# EAGLE design powerSMALL_smaller (EAGLE 9.0.0)
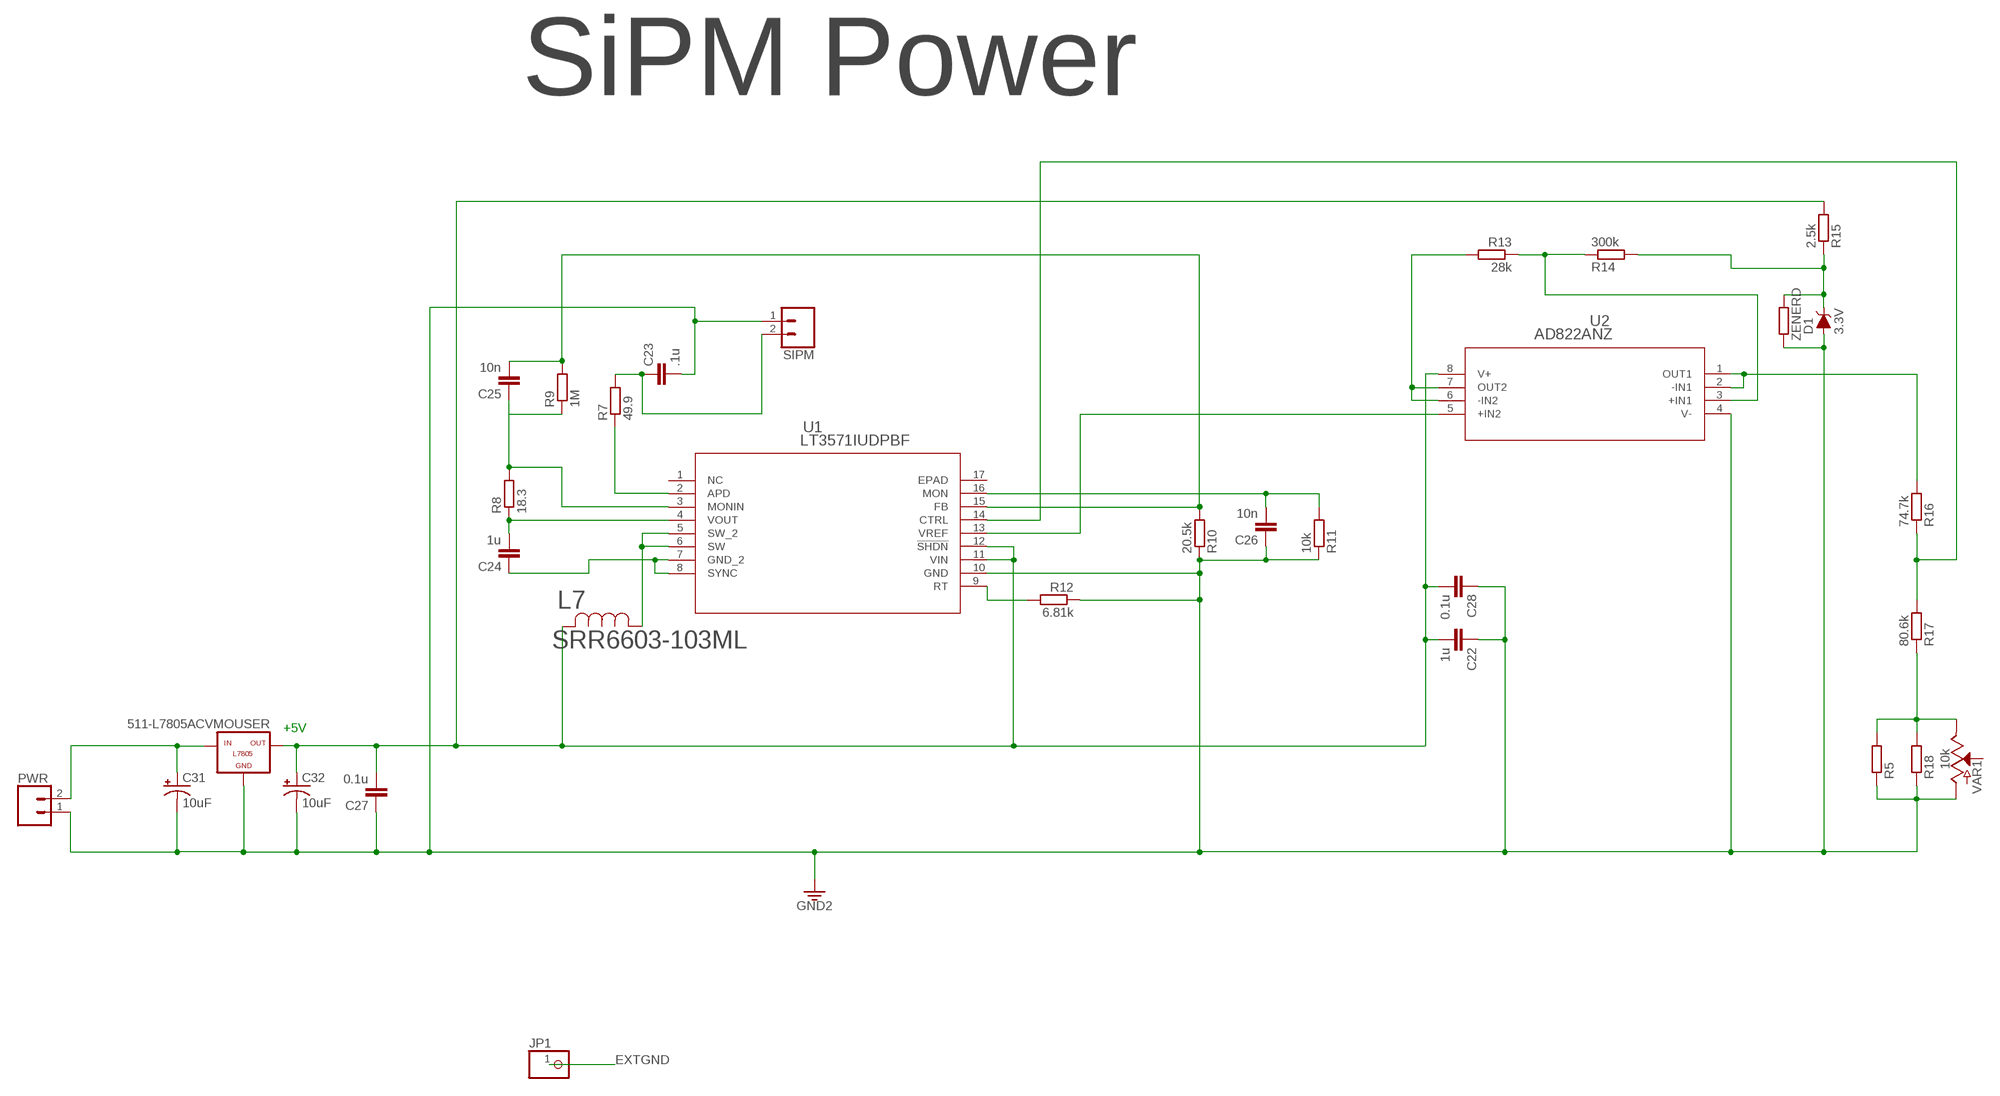
[diagram p0: schematic, sheet 1, part 1 of 2]
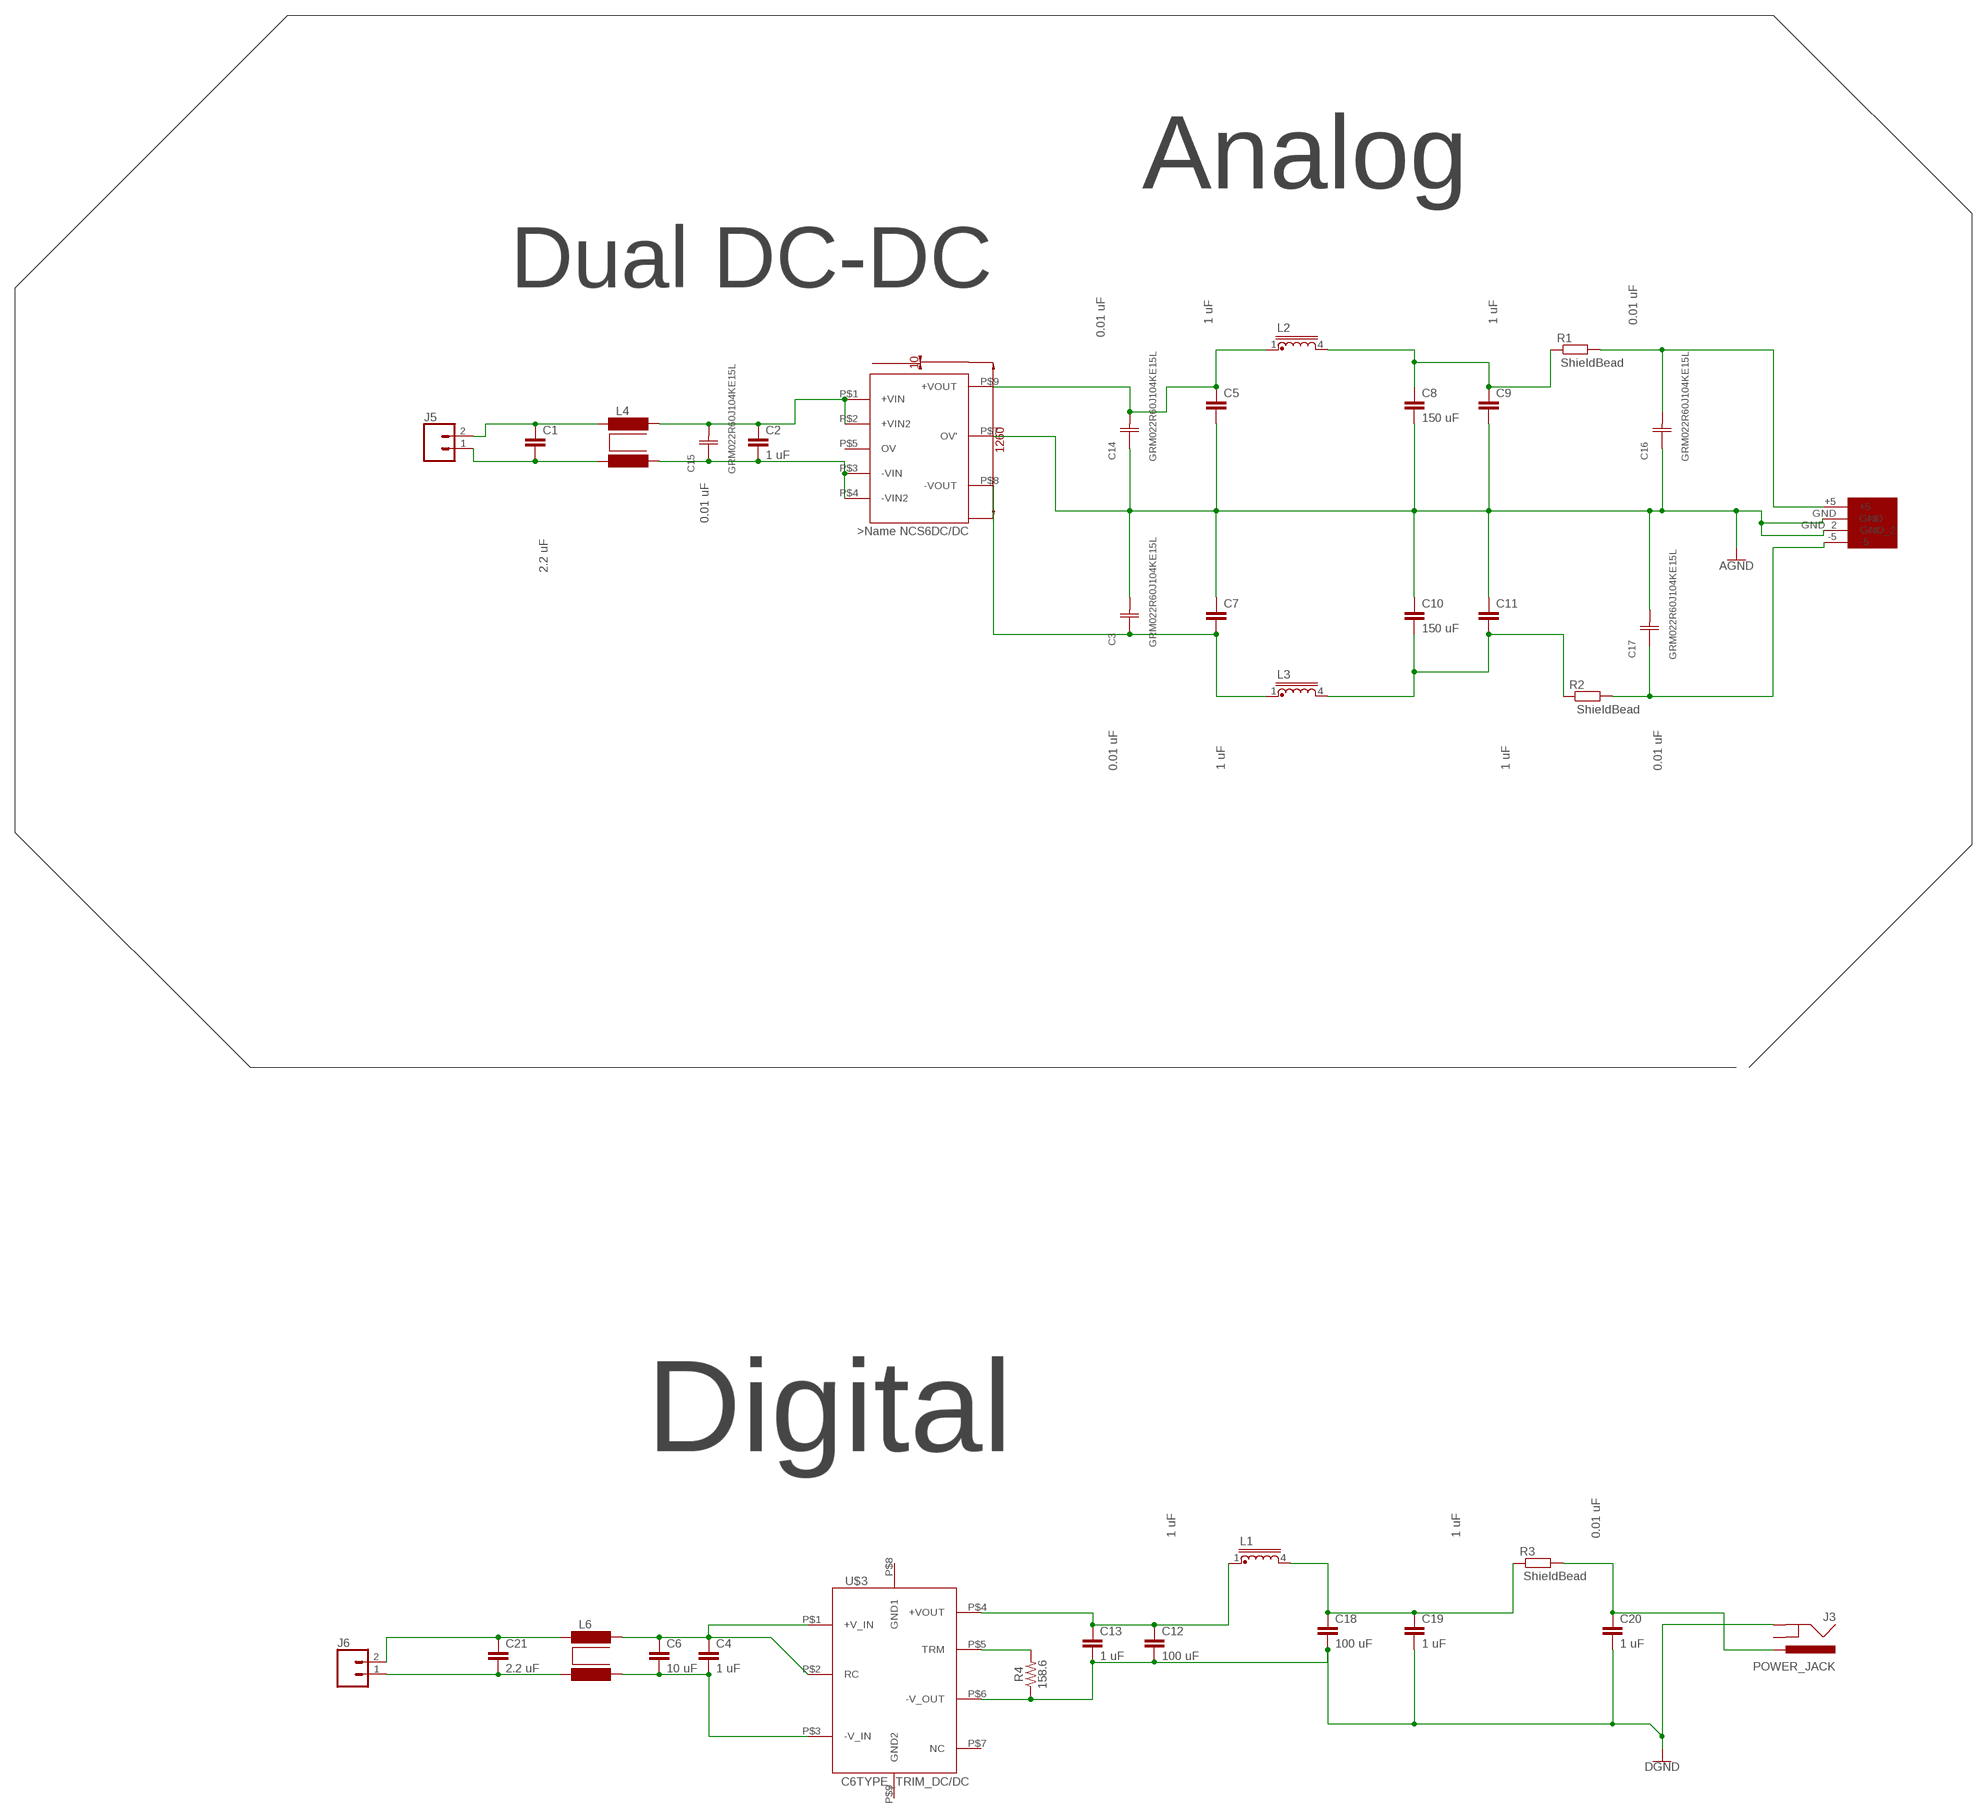
[diagram p1: schematic, sheet 1, part 2 of 2]

## Parts
511-L7805ACVMOUSER  -L7805  [L7805]
C1  C2.5/2  [C2.5-2]
C2  1 uF  10NF-PTH-10MM-10000V-1-%  [CAP-PTH-10MM]
C3  GRM022R60J104KE15L  [CAP_GRM02L_P42XP22]
C4  1 uF  10NF-PTH-10MM-10000V-1-%  [CAP-PTH-10MM]
C5  C2.5/2  [C2.5-2]
C6  10 uF  10NF-PTH-10MM-10000V-1-%  [CAP-PTH-10MM]
C7  C2.5/2  [C2.5-2]
C8  150 uF  10NF-PTH-10MM-10000V-1-%  [CAP-PTH-10MM]
C9  C2.5/2  [C2.5-2]
C10  150 uF  10NF-PTH-10MM-10000V-1-%  [CAP-PTH-10MM]
C11  C2.5/2  [C2.5-2]
C12  100 uF  10NF-PTH-10MM-10000V-1-%  [CAP-PTH-10MM]
C13  1 uF  10NF-PTH-10MM-10000V-1-%  [CAP-PTH-10MM]
C14  GRM022R60J104KE15L  [CAP_GRM02L_P42XP22]
C15  GRM022R60J104KE15L  [CAP_GRM02L_P42XP22]
C16  GRM022R60J104KE15L  [CAP_GRM02L_P42XP22]
C17  GRM022R60J104KE15L  [CAP_GRM02L_P42XP22]
C18  100 uF  10NF-PTH-10MM-10000V-1-%  [CAP-PTH-10MM]
C19  1 uF  10NF-PTH-10MM-10000V-1-%  [CAP-PTH-10MM]
C20  1 uF  10NF-PTH-10MM-10000V-1-%  [CAP-PTH-10MM]
C21  2.2 uF  10NF-PTH-10MM-10000V-1-%  [CAP-PTH-10MM]
C22  1u  C2.5/2  [C2.5-2]
C23  .1u  C2.5/2  [C2.5-2]
C24  1u  C2.5/2  [C2.5-2]
C25  10n  C2.5/2  [C2.5-2]
C26  10n  C2.5/2  [C2.5-2]
C27  0.1u  C2.5/2  [C2.5-2]
C28  0.1u  C2.5/2  [C2.5-2]
C31  10uF  10UF-POLAR-0603-6.3V-20%(TANT)  [0603-POLAR]
C32  10uF  10UF-POLAR-0603-6.3V-20%(TANT)  [0603-POLAR]
D1  3.3V  DIODE-ZENER-MM3Z3V3T1G  [SOD-323]
J3  POWER_JACK  [POWER_JACK_PTH]
J5  CONN_02PTH4  [1X02_XTRA_BIG]
J6  CONN_02PTH4  [1X02_XTRA_BIG]
JP1  PINHD-1X1  [1X01]
L1  U15-CHOKE  [U15CHOKE]
L2  U15-CHOKE  [U15CHOKE]
L3  U15-CHOKE  [U15CHOKE]
L4  SMR6-I  [SM-R6]
L6  SMR6-I  [SM-R6]
L7  SRR6603-103ML  [IND_BOURNS_SRR6603]
PWR  CONN_02PTH4  [1X02_XTRA_BIG]
R1  R0207/10  [0207/10]
R2  R0207/10  [0207/10]
R3  R0207/10  [0207/10]
R4  158.6  10MOHM-HORIZ-1/4W-5%  [AXIAL-0.3]
R5  R0207/10  [0207/10]
R7  49.9  R0207/10  [0207/10]
R8  18.3  R0207/10  [0207/10]
R9  1M  R0207/10  [0207/10]
R10  20.5k  R0207/10  [0207/10]
R11  10k  R0207/10  [0207/10]
R12  6.81k  R0207/10  [0207/10]
R13  28k  R0207/10  [0207/10]
R14  300k  R0207/10  [0207/10]
R15  2.5k  R0207/10  [0207/10]
R16  74.7k  R0207/10  [0207/10]
R17  80.6k  R0207/10  [0207/10]
R18  R0207/10  [0207/10]
SIPM  CONN_02PTH4  [1X02_XTRA_BIG]
U1  LT3571IUDPBF  [QFN-16_UD]
U2  AD822ANZ  [N_8]
U$1  NCS6D1205  [NCS6D1205C]
U$3  C6TYPE_TRIM_DC/DC  [CONV/DC/DC_6W_SNGL_C6TYPE]
U$4  WM403_NDPOWER_JACK  [WM4302-ND]
VAR1  10k  POTENTIOMETER-PTH-9MM-1/20W-20%  [POT-PTH-ALPS]
ZENERD  R0207/10  [0207/10]

## Nets
5VSUPPLY: 511-L7805ACVMOUSER.OUT C22.2 C27.2 C28.2 C32.+ L7.2 R15.2 U1.11(VIN) U1.12(!SHDN) U2.8(V+)
-FINV: C16.2 R1.2 U$4.+5
AGND: C3.2 C5.2 C7.1 C8.2 C9.2 C10.1 C11.1 C14.1 C16.1 C17.2 U$1.P$7(OV') U$4.GND U$4.GND_2
DGND: C12.2 C13.2 C18.2 C19.2 C20.2 J3.GND R4.P$1 U$3.P$6(-V_OUT)
EXTGND: JP1.1
N$1: C1.1 J5.2 L4.1
N$2: C1.2 J5.1 L4.4
N$3: C3.1 C7.2 L3.1 U$1.P$8(-VOUT)
N$4: C2.1 C15.2 L4.8 U$1.P$1(+VIN) U$1.P$2(+VIN2)
N$5: C5.1 C14.2 L2.1 U$1.P$9(+VOUT)
N$6: C8.1 C9.1 L2.4 R1.1
N$7: R13.2 U2.6(-IN2) U2.7(OUT2)
N$8: C10.2 C11.2 L3.4 R2.1
N$9: C17.1 R2.2 U$4.-5
N$10: C21.1 J6.2 L6.1
N$11: C21.2 J6.1 L6.4
N$12: C4.1 C6.1 L6.8 U$3.P$1(+V_IN) U$3.P$2(RC)
N$13: C4.2 C6.2 L6.5 U$3.P$3(-V_IN)
N$14: C24.2 R8.1 U1.4(VOUT)
N$15: C20.1 J3.PWR R3.2
N$16: R4.P$2 U$3.P$5(TRM)
N$17: C18.1 C19.1 L1.4 R3.1
N$18: C24.1 U1.7(GND_2) U1.8(SYNC)
N$19: C12.1 C13.1 L1.1 U$3.P$4(+VOUT)
N$20: R7.1 U1.2(APD)
N$21: C23.1 R7.2 SIPM.2
N$22: C25.1 R8.2 R9.1 U1.3(MONIN)
N$23: C26.2 R11.2 U1.16(MON)
N$24: L7.1 U1.5(SW_2) U1.6(SW)
N$25: U1.13(VREF) U2.5(+IN2)
N$27: R16.2 U2.1(OUT1) U2.2(-IN1)
N$28: C25.2 R9.2 R10.2 U1.15(FB)
N$29: R13.1 R14.1 U2.3(+IN1)
N$30: R12.2 U1.9(RT)
N$31: D1.C R14.2 R15.1 ZENERD.2
N$33: R16.1 R17.2 U1.14(CTRL)
N$34: R5.2 R17.1 R18.2 VAR1.P$1(E)
N$35: C2.2 C15.1 L4.5 U$1.P$3(-VIN) U$1.P$4(-VIN2)
N$36: 511-L7805ACVMOUSER.IN C31.+ PWR.2
SIPMGND: 511-L7805ACVMOUSER.GND C22.1 C23.2 C26.1 C27.1 C28.1 C31.- C32.- D1.A PWR.1 R5.1 R10.1 R11.1 R12.1 R18.1 SIPM.1 U1.10(GND) U2.4(V-) VAR1.P$3(A) ZENERD.1 ; supply symbol labelled GND2
Unconnected: J3.GNDBREAK U1.1(NC) U1.17(EPAD) U$1.P$5(OV) U$3.P$7(NC) U$3.P$8(GND1) U$3.P$9(GND2) VAR1.P$2(S)

## Notes on the sheet
- SiPM Power
- +5V
- Analog
- Dual DC-DC
- 1 uF | 1 uF
- 0.01 uF
- 0.01 uF
- ShieldBead
- 0.01 uF
- 2.2 uF
- ShieldBead
- 1 uF | 1 uF
- 0.01 uF | 0.01 uF
- Digital
- 1 uF | 1 uF
- 0.01 uF
- ShieldBead

## Library data of the parts
511-L7805ACVMOUSER = tango:-L7805
C1 C5 C7 C9 C11 C22-C28 = capacitor-wima:C: CAPACITOR naming: grid - package width
C2 C4 C6 C8 C10 C12 C13 C18-C21 = SparkFun-Capacitors:10NF: 0.01uF/10nF/10,000pF ceramic capacitors A capacitor is a passive two-terminal electrical component used to store electrical energy temporarily in an electric field. CAP-09321; PROD_ID: CAP-09321; VALUE: 10nF
C3 C14-C17 = 00_1uFCeramic:GRM022R60J104KE15L; MANUFACTURER_PART_NUMBER: GRM022R60J104KE15L; VENDOR: Murata
C31 C32 = SparkFun-Capacitors:10UF-POLAR: 10.0µF polarized capacitors A capacitor is a passive two-terminal electrical component used to store electrical energy temporarily in an electric field.; PROD_ID: CAP-13210
D1 = SparkFun-DiscreteSemi:DIODE-ZENER: Zener Diode A Zener diode allows current to flow from its anode to its cathode like a normal semiconductor diode, but it also permits current to flow in the reverse direction when its "Zener voltage" is reached. - WIkipedia; PROD_ID: DIO-11284
J3 = SparkFun-Connectors:POWER_JACK: Power Jack Connector This is the standard 5.5mm barrel jack for power. The PTH is the most common, proven, reliable, footprint. The Slot footprint only works if the mill layer is transmitted to the PCB fab house so be warned. Here are the connectors we sell at SparkFun: DC Barrel Power Jack/Connector <https://www.sparkfun.com/products/119> (PRT-00119) DC Barrel Power Jack/Connector (SMD) <https://www.sparkfun.com/products/12748> (PRT-12748) DC Barrel Jack Adapter - Breadboard Compatible <https://www.sparkfun.com/products/10811> (PRT-10811) It is used on this SparkFun product (and many, many others): SparkFun RedBoard - Programmed with Arduino <https://www.sparkfun.com/products/12757> (DEV-12757) Also, if you need a mating power supply or connector, please check these out: Wall Adapter Power Supply - 9VDC 650mA <https://www.sparkfun.com/products/298> (TOL-00298) DC Barrel Jack Adapter - Male <https://www.sparkfun.com/products/10287> (PRT-10287); PROD_ID: CONN-08197
J5 J6 PWR SIPM = SparkFun-Connectors:CONN_02: Multi connection point. Often used as Generic Header-pin footprint for 0.1 inch spaced/style header connections On any of the 0.1 inch spaced packages, you can populate with these: Break Away Headers - Straight <https://www.sparkfun.com/products/116> (PRT-00116) Break Away Male Headers - Right Angle <https://www.sparkfun.com/products/553> (PRT-00553) Female Headers <https://www.sparkfun.com/products/115> (PRT-00115) Break Away Headers - Machine Pin <https://www.sparkfun.com/products/117> (PRT-00117) Break Away Female Headers - Swiss Machine Pin <https://www.sparkfun.com/products/743> (PRT-00743) For SCREWTERMINALS and SPRING TERMINALS visit here: Screw Terimnals on SparkFun.com <https://www.sparkfun.com/search/results?term=Screw+Terminals> (5mm/3.5mm/2.54mm spacing) This device is also useful as a general connection point to wire up your design to another part of your project. Our various solder wires solder well into these plated through hole pads. Hook-Up Wire - Assortment (Stranded, 22 AWG) <https://www.sparkfun.com/products/11375> (PRT-11375) Hook-Up Wire - Assortment (Solid Core, 22 AWG) <https://www.sparkfun.com/products/11367> (PRT-11367) View the entire wire category on our website here <https://www.sparkfun.com/categories/141> Special notes: Molex polarized connector foot print use with: PRT-08233 with associated crimp pins and housings. 2.54_SCREWTERM for use with PRT-10571. 3.5mm Screw Terminal footprints for PRT-08084 5mm Screw Terminal footprints for use with PRT-08432
JP1 = adafruit:PINHD-1X1: Pin header 1x1 for 0.1" spacing With round pins
L1-L3 = inductor-neosid:U15-: CHOKE U15; OC_FARNELL: unknown; OC_NEWARK: unknown
L4 L6 = inductor-neosid:SMR6-I: CHOKE current compensated toroidal-core choke; OC_FARNELL: unknown; OC_NEWARK: unknown
L7 = SRR6603-10MLTR-ND:SRR6603-103ML; MANUFACTURER_PART_NUMBER: SRR6603103ML; VENDOR: Bourns Electronics
R1-R3 R5 R7-R18 ZENERD = eagle-ltspice:R: RESISTOR, European symbol; SPICEMODEL: NONE; SPICEPREFIX: R
R4 = SparkFun-Resistors:10MOHM: RES-09327; PROD_ID: RES-09327; VALUE: 10M
U1 = LT3571:LT3571IUDPBF; MANUFACTURER_PART_NUMBER: LT3571IUD#PBF; VENDOR: Linear Technology
U2 = AD822ANZ_opAmp:AD822ANZ; MANUFACTURER_PART_NUMBER: AD822ANZ; VENDOR: Analog Devices Inc
U$1 = LAFTRPWR:NCS6D1205
U$3 = DCDC_Trim:C6TYPE_TRIM_DC/DC
U$4 = WM4302-ND:WM403_ND
VAR1 = SparkFun-Resistors:POTENTIOMETER: Potentiometer (Pot) Three-terminal potentiometers, with an adjustable wiper and two adjustable resistors. A pot can be used to create a configurable voltage divider, or as a variable resistor. Variants ALPS_POT and ALPS_POT_KIT - PTH, breadboard compatible, 9mm square pots Rotary Potentiometer - Linear (10k ohm) <https://www.sparkfun.com/products/9288> (COM-09288) The KIT variant exposes copper on only one side of the PTH pad, so the part can only be assembled on one side of the PCB. Useful for beginner soldering kits.; PROD_ID: RES-09177; SF_SKU: COM-09288

## Board
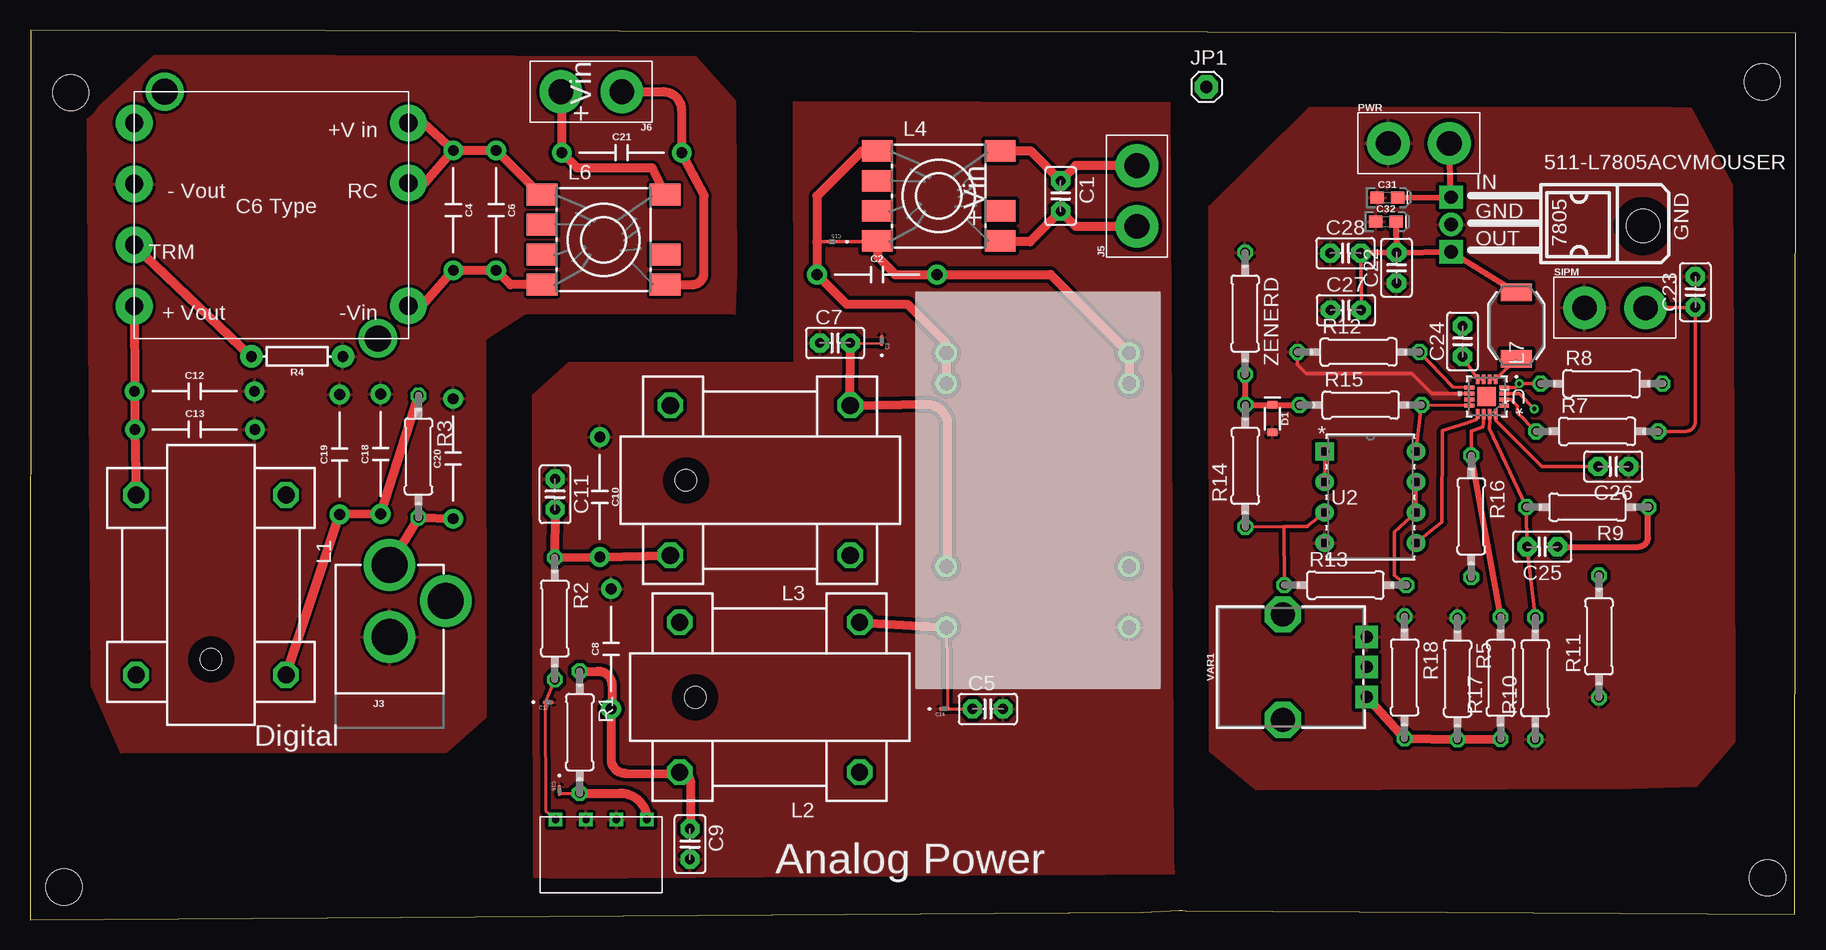
[diagram p2: board, top side]
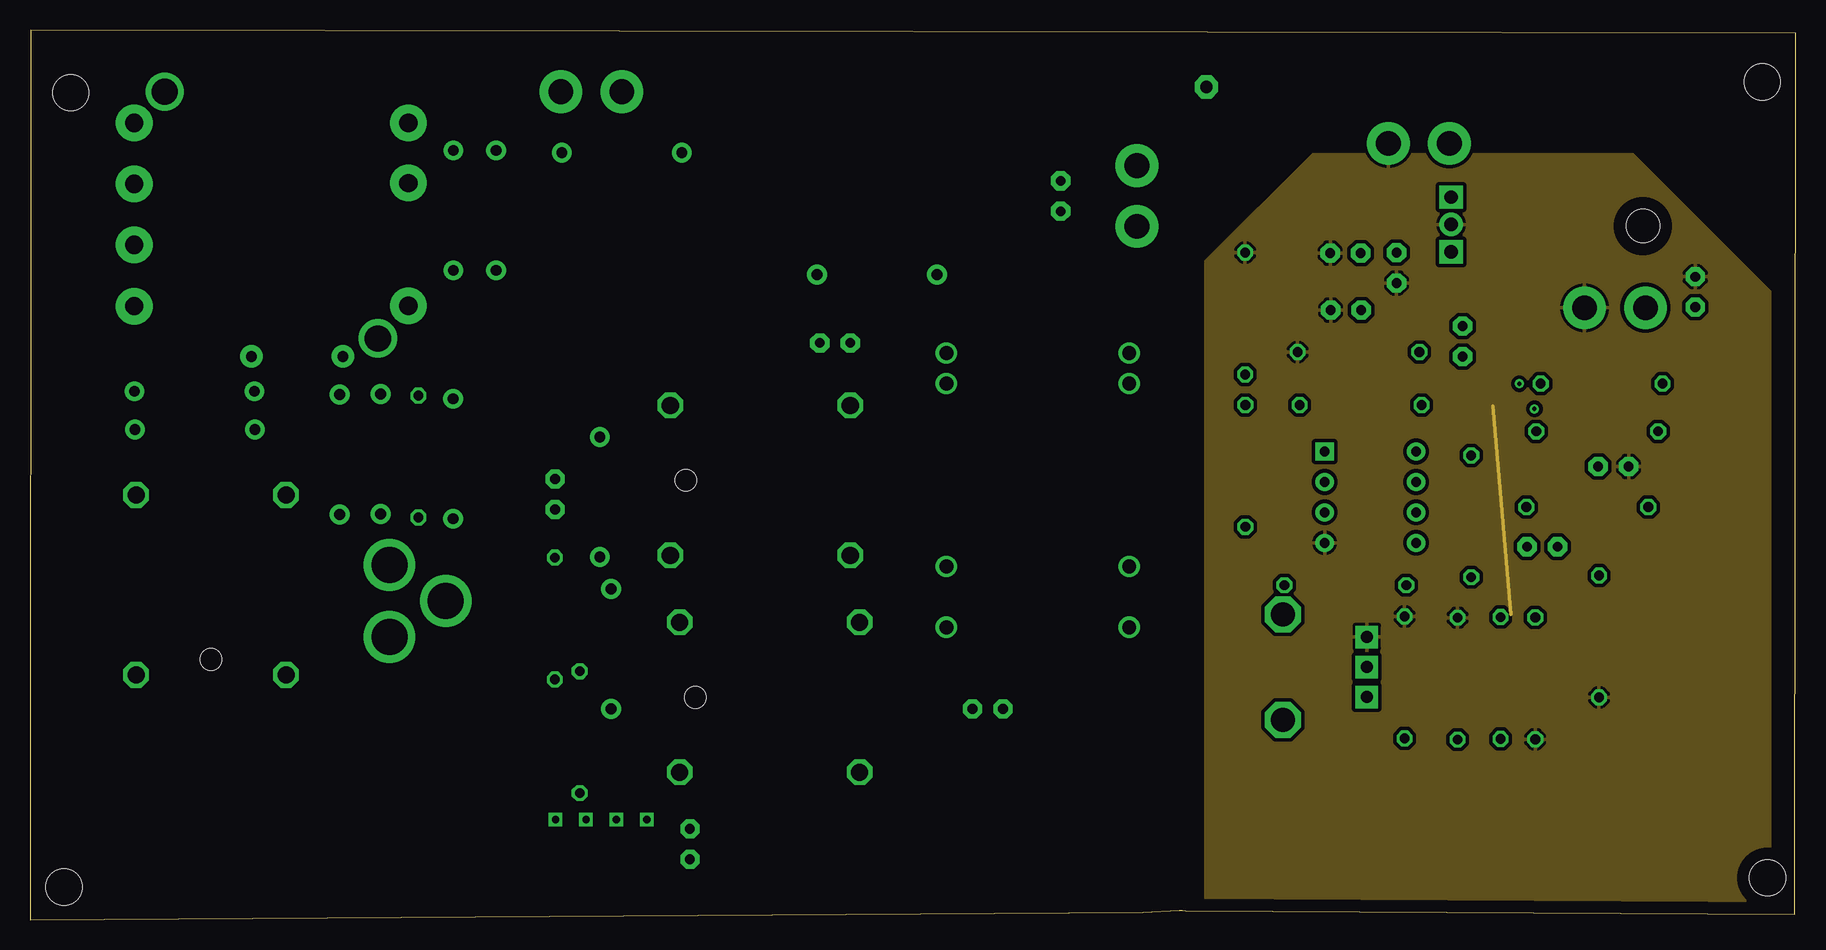
[diagram p3: board, inner layer Route2]
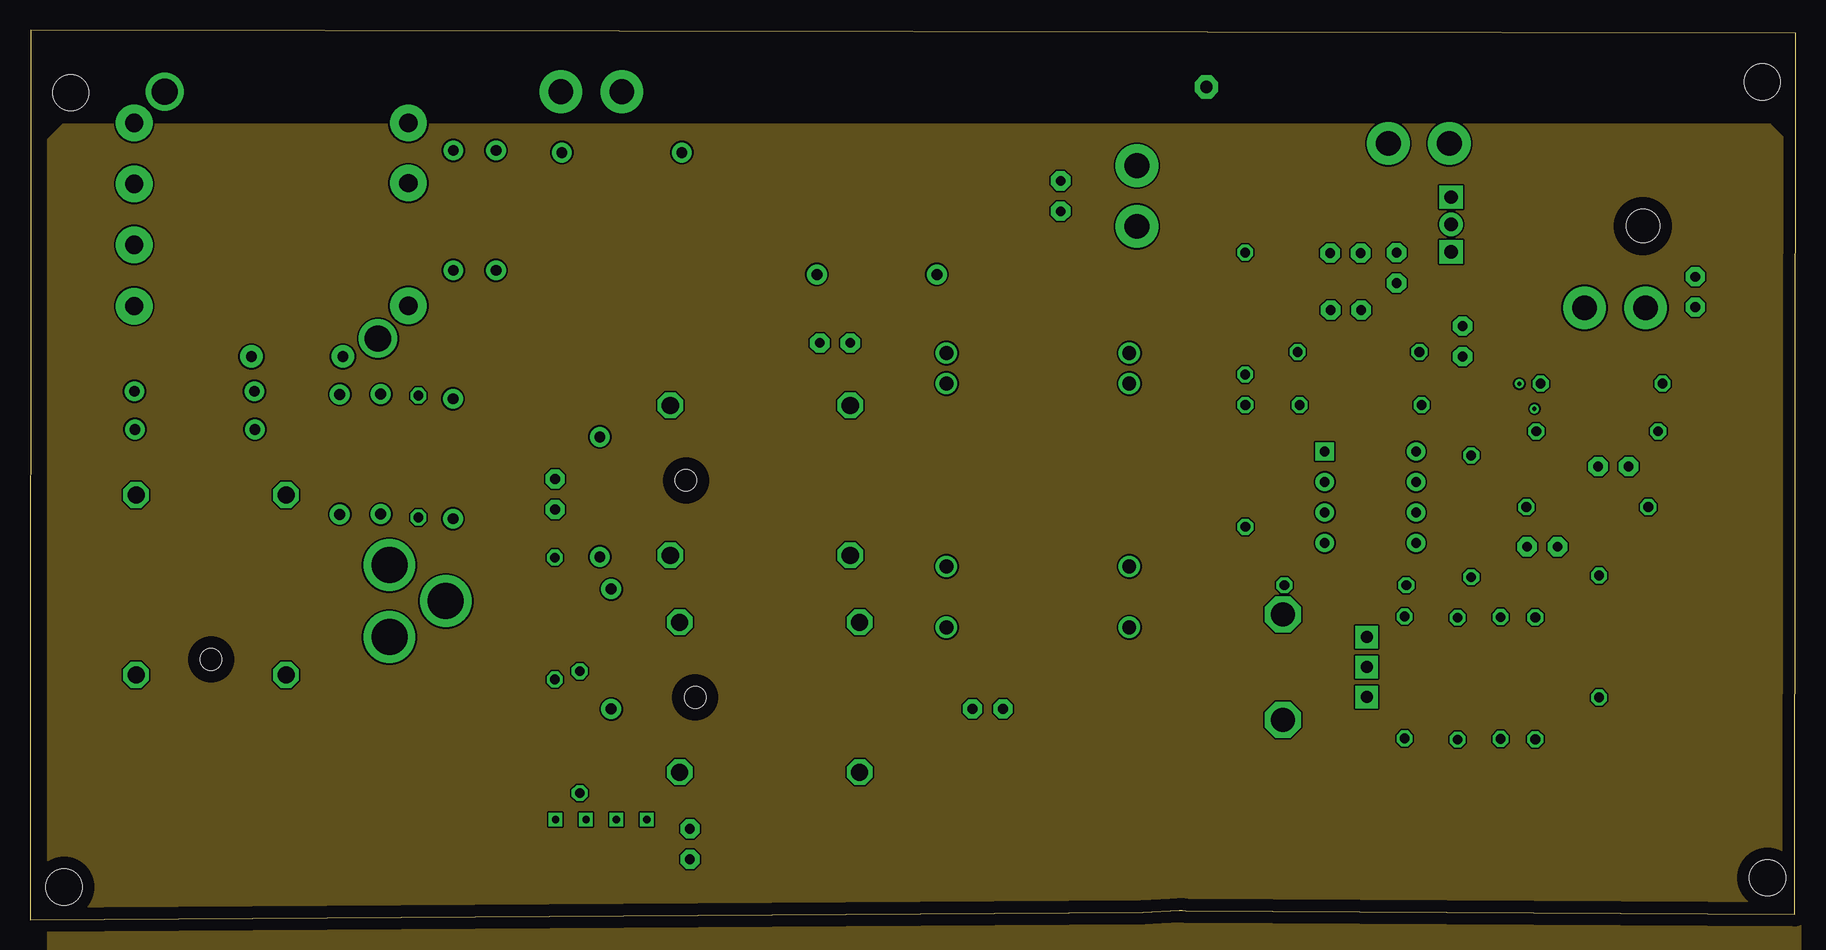
[diagram p4: board, inner layer Route15]
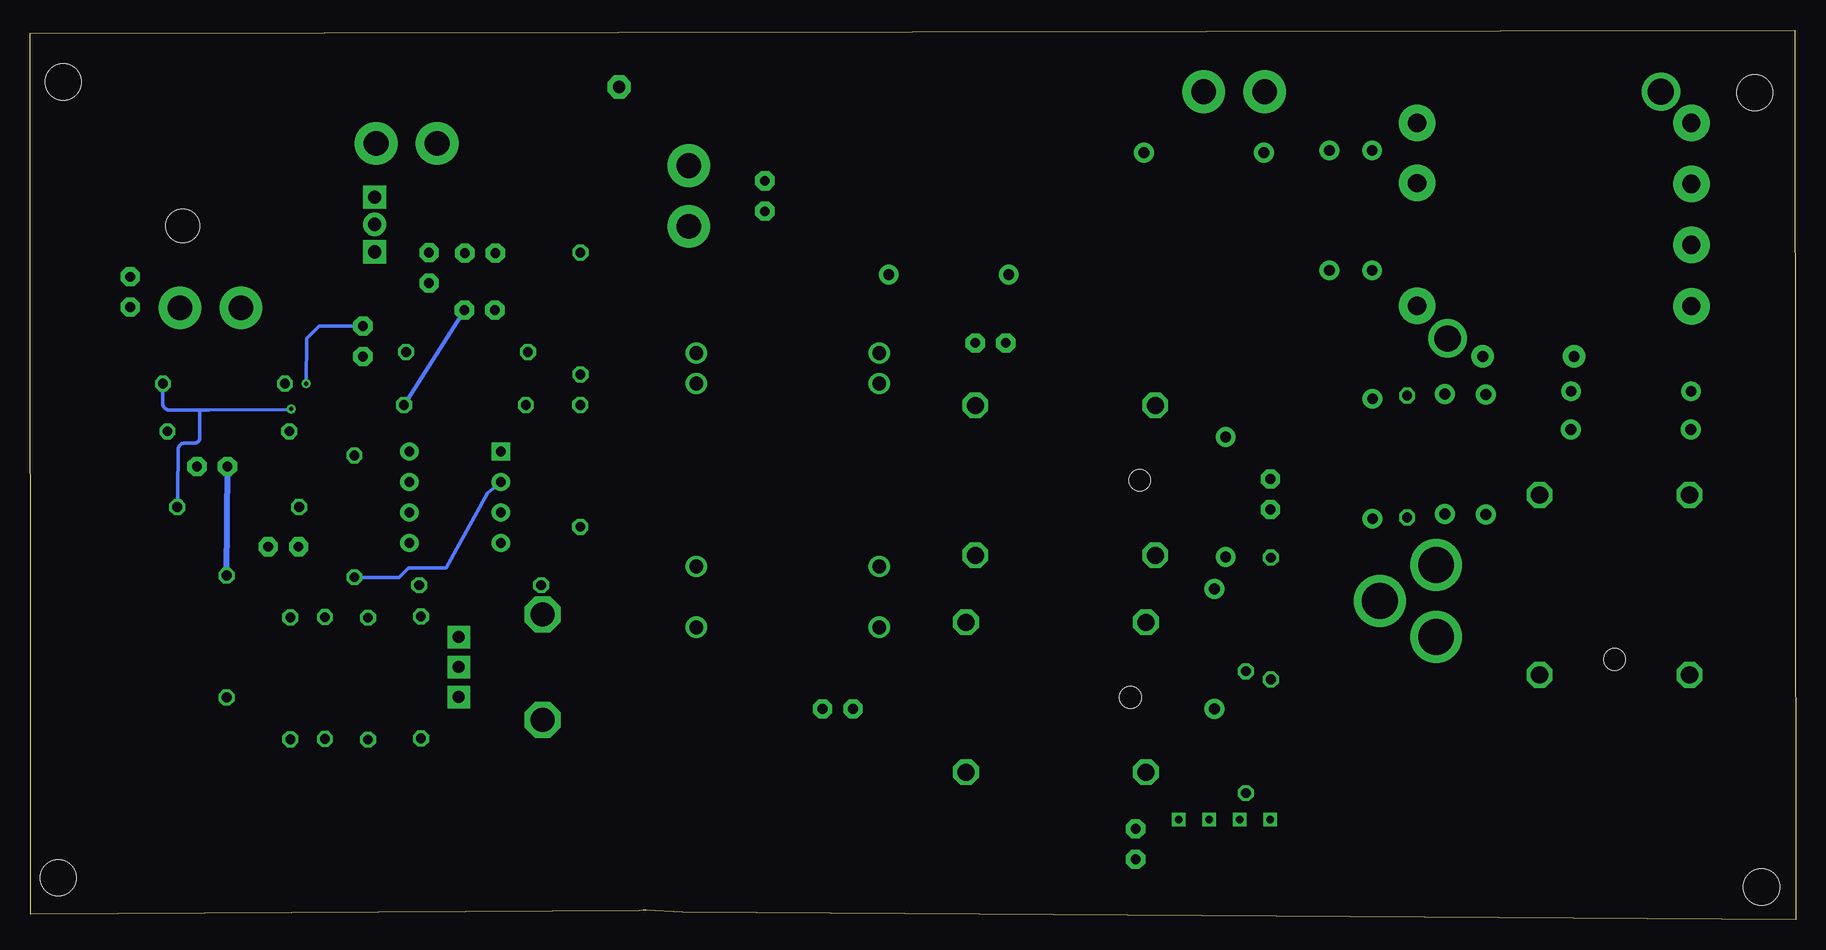
[diagram p5: board, bottom side, seen from below]

Size 147.17 x 74.2 mm. Coordinates in mm from the lower left corner, seen from the top.
Outline: 0,0 92.77,0.62 95.83,0.82 96.06,0.82 96.34,0.76 147.12,0.46 147.17,73.93 0.07,74.2 0,0
Copper layers (1*2+15*16): Top 0.035mm / dielectric 1.5mm / Route2 0.035mm / dielectric 0.15mm / Route15 0.035mm / dielectric 0.2mm / Bottom 0.035mm
Design rules "default *": minimum track width 6mil, minimum drill 0.35mm, track to track 6mil, track to pad 6mil, pad to pad 6mil, via to via 6mil, smd to smd 6mil, copper to edge 40mil, drill to drill 6mil, minimum pad ring 10mil, minimum via ring 8mil, stop-mask expansion 4mil, vias tented up to drill 0mil, thermal gap 10mil
Holes 3 mm at 3.4,68.97 2.83,2.74 144.39,69.86 144.83,3.51

### Footprints (pad centres in the part's own frame; a part is rotated, then mirrored left to right if it is on the bottom)
L7805 = drill 1.1 pad 1.93: GND 0.127,-9.652 | drill 1.1 pad 1.93 square: IN -2.159,-9.652; OUT 2.413,-9.652 | hole 2.8: 0.254,6.35
C2.5-2 = drill 0.813 pad 1.6 octagon: 1 -1.27,0; 2 1.27,0
CAP-PTH-10MM = drill 0.9 pad 1.651: 1 -5,0; 2 5,0
CAP_GRM02L_P42XP22 = smd 0.356 x 0.229: 1 -0.241,0; 2 0.241,0
0603-POLAR = smd 1.1 x 1: + 0.85,0; - -0.85,0
SOD-323 = smd 0.63 x 0.83: A 1.15,0; C -1.15,0
POWER_JACK_PTH = drill 2.997 pad 4.318: GND 0,7.7; GNDBREAK 4.7,10.7; PWR 0,13.7
1X02_XTRA_BIG = drill 2.057 pad 3.556: 1 -2.54,0; 2 2.54,0
1X01 = drill 1.016 pad 1.93 octagon: 1 0,0
U15CHOKE = drill 1.422 octagon: 1 -7.5,-6.25; 4 7.5,6.25; U2 -7.5,6.25; U3 7.5,-6.25 | hole 1.8: 6.2,0
SM-R6 = smd 1.8 x 2.55: 1 -3.75,5.125; 3 1.25,5.125; 4 3.75,5.125; 5 3.75,-5.125; 6 1.25,-5.125; 7 -1.25,-5.125; 8 -3.75,-5.125
IND_BOURNS_SRR6603 = smd 1.46 x 2.591: 1 -2.775,0; 2 2.775,0
0207/10 = drill 0.813 octagon: 1 -5.08,0; 2 5.08,0
AXIAL-0.3 = drill 0.9 pad 1.88: P$1 -3.81,0; P$2 3.81,0
QFN-16_UD = smd 0.805 x 0.3: 1 -1.452,0.75; 2 -1.452,0.25; 3 -1.452,-0.25; 4 -1.452,-0.75; 9 1.452,-0.75; 10 1.452,-0.25; 11 1.452,0.25; 12 1.452,0.75 | smd 0.3 x 0.805: 5 -0.75,-1.452; 6 -0.25,-1.452; 7 0.25,-1.452; 8 0.75,-1.452; 13 0.75,1.452; 14 0.25,1.452; 15 -0.25,1.452; 16 -0.75,1.452 | smd 1.55 x 1.55: 17 0,0
N_8 = drill 0.813 pad 1.524 square: 1 -7.62,7.62 | drill 0.813 pad 1.524: 2 -7.62,5.08; 3 -7.62,2.54; 4 -7.62,0; 5 0,0; 6 0,2.54; 7 0,5.08; 8 0,7.62
NCS6D1205C = drill 1.143 pad 1.778: P$1 0,0; P$2 2.54,0; P$3 0,15.24; P$4 2.54,15.24; P$5 17.78,15.24; P$7 22.86,15.24; P$8 17.78,0; P$9 22.86,0
CONV/DC/DC_6W_SNGL_C6TYPE = drill 1.524 pad 3.048: P$1 0,2.616; P$2 0,7.62; P$3 0,17.856; P$4 22.86,17.882; P$5 22.86,12.776; P$6 22.86,7.696; P$7 22.86,2.616 | drill 2.184 pad 3.048: P$8 2.54,20.574; P$9 20.32,0
WM4302-ND = drill 0.6 square: +5 1.27,0.23; -5 8.89,0.23; GND 3.81,0.23; GND_2 6.35,0.23
POT-PTH-ALPS = drill 1 pad 1.88 square: P$1 7,-2.5; P$2 7,0; P$3 7,2.5 | drill 2 octagon: P$4 0,-4.4; P$5 0,4.4

### Placement (x,y rotation side)
511-L7805ACVMOUSER  128.1,58.11 270 top
C1  85.91,60.35 270 top
C2  70.59,53.81 0 top
C3  71,48.31 90 top
C4  35.29,59.16 270 top
C5  79.84,17.58 0 top
C6  38.85,59.16 270 top
C7  67.11,48.1 0 top
C8  48.44,22.59 90 top
C9  55.01,6.31 270 top
C10  47.5,35.26 270 top
C11  43.77,35.48 270 top
C12  13.71,44.08 0 top
C13  13.74,40.89 0 top
C14  76.23,17.6 0 top
C15  66.86,56.54 180 top
C16  44.12,10.79 270 top
C17  43.2,18.15 0 top
C18  29.24,38.83 90 top
C19  25.82,38.8 90 top
C20  35.26,38.45 90 top
C21  49.33,63.97 0 top
C22  113.91,54.37 90 top
C23  138.81,52.35 90 top
C24  119.42,48.23 90 top
C25  126.06,31.11 180 top
C26  131.98,37.8 180 top
C27  109.69,50.84 0 top
C28  109.65,55.59 0 top
C31  113.14,60.22 0 top
C32  113.02,58.21 0 top
D1  103.55,41.79 270 top
J3  29.96,15.89 0 top
J5  92.26,60.35 90 top
J6  46.79,69.05 180 top
JP1  98.07,69.45 0 top
L1  15.09,27.92 270 top
L2  61.65,18.55 180 top
L3  60.87,36.65 180 top
L4  75.75,60.35 270 top
L6  47.81,56.71 270 top
L7  123.9,49.55 90 top
PWR  115.77,64.74 0 top
R1  45.82,15.65 270 top
R2  43.74,25.12 270 top
R3  32.38,38.63 270 top
R4  22.27,46.98 180 top
R5  119,20.11 270 top
R7  130.64,40.73 0 top
R8  131,44.71 0 top
R9  129.82,34.41 180 top
R10  125.47,20.14 90 top
R11  130.79,23.63 90 top
R12  110.74,47.34 0 top
R13  109.64,27.91 0 top
R14  101.3,37.85 90 top
R15  110.92,42.92 0 top
R16  120.13,33.65 270 top
R17  122.59,20.16 90 top
R18  114.58,20.21 270 top
SIPM  132.12,51.03 0 top
U1  121.43,43.63 180 top
U2  115.54,31.43 0 top
U$1  76.39,47.25 270 top
U$3  31.55,69.05 180 top
U$4  52.69,8.59 180 top
VAR1  104.43,21.08 0 top
ZENERD  101.29,50.56 270 top

### Tracks (layer width: path | path; a pad name or v marks a point on that pad's centre or on a via)
5VSUPPLY
  Top 0.305: U1.11 U1.12 R15.2 U2.8 | C28.2 C27.2
  Top 0.508: C32.+ C22.2 | C22.2 C28.2 | C22.2 511-L7805ACVMOUSER.OUT L7.2
  Bottom 0.305: C27.2 R15.2
-FINV
  Top 0.254: C16.2 R1.2
  Top 0.762: R1.2 49.21,10.57 arc-90 U$4.+5
AGND
  pour Route2 (isolate 0.356): -54.36,101.9 -54.36,76.5 -55.63,75.23 -74.68,73.96 -75.95,72.69 -75.95,19.35 -27.69,19.35 -23.88,24.43 -23.88,101.9
  pour Top (isolate 0.305): 63.7,68.23 94.98,68.14 95.28,4.9 95.34,3.82 44.11,3.47 42,3.56 41.92,43.77 44.93,46.45 63.73,46.48 63.72,47.99
DGND
  pour Route2 (isolate 0.305): -100.08,67.61 -96.27,62.53 -96.27,47.29 -97.54,46.02 -117.86,46.02 -119.13,43.48 -119.13,-6.05 -121.67,-8.59 -148.34,-8.59 -154.69,-2.24 -154.69,58.72 -145.8,67.61
  pour Top (isolate 0.254): 4.81,66.92 10.39,72.07 55.5,71.95 58.76,68.31 58.84,54.07 58.73,50.5 41.28,50.54 37.95,48.37 37.97,16.86 34.68,13.97 7.6,13.92 5.16,19.52
EXTGND
  pour Route15: 2.79,66.34 145.03,66.34 147.57,63.8 147.57,-11.13 145.03,-13.67 9.14,-13.67 1.52,-6.05 1.52,65.07
N$1
  Top 0.762: J5.2 87.18,62.89 C1.1 83.43,64.1 L4.1
N$2
  Top 0.762: J5.1 87.18,57.81 C1.2 83.37,56.54 80.94,56.54 L4.4
N$3
  Top 0.254: C7.2 C3.1
  Top 0.762: C7.2 L3.1 74.76,42.99 arc-90 76.49,41.27 76.49,29.57 arc-90 U$1.P$8
N$4
  Top 0.305: C15.2 65.59,56.54
  Top 0.762: L4.8 69.34,64.1 65.59,60.35 65.59,56.54 C2.1 68.08,51.32 73.13,51.32 76.39,48.07 U$1.P$1 U$1.P$2
N$5
  Top 0.254: U$1.P$9 C14.2 C5.1
  Top 0.762: L2.1 U$1.P$9
N$6
  Top 0.762: C9.1 arc90 55.06,7.64 55.06,11.45 arc90 54.34,12.17 L2.4 arc-90 53.29,12.17 49.58,12.24 arc-90 48.44,13.37 C8.1 arc90 48.5,17.65 48.5,19.61 arc90 47.38,20.73 R1.1
N$7
  Top 0.305: U2.7 U2.6 113.74,32.35 113.74,28.71 R13.2
N$8
  Top 0.762: C11.2 R2.1 C10.2 L3.4
N$9
  Top 0.254: R2.2 C17.1 42.99,9.05 U$4.-5
N$10
  Top 0.762: J6.2 44.33,68.97 C21.1 45.6,62.7 51.87,62.7 L6.1
N$11
  Top 0.762: J6.1 52.78,69.05 arc-90 54.3,67.53 54.3,64 arc90 C21.2 56.23,60.37 56.17,60.37 56.17,53.92 arc-90 55.21,52.96 L6.4
N$12
  Top 0.762: C4.1 32.81,66.44 U$3.P$1 | C4.1 32.9,61.43 U$3.P$2 | L6.8 42.54,60.46 C6.1 C4.1
N$13
  Top 0.762: U$3.P$3 32.66,51.2 C4.2 C6.2 40.04,52.96 L6.5
N$14  (via drill 0.35)
  Top 0.305: R8.1 v124.15,44.7 123.83,44.38 U1.4
  Bottom 0.305: v124.15,44.7 124.1,48.48 123.07,49.5 C24.2
N$15
  Top 0.762: C20.1 R3.2 J3.PWR
N$16
  Top 0.762: U$3.P$5 R4.P$2
N$17
  Top 0.762: R3.1 C18.1 C19.1 L1.4
N$18
  Top 0.305: U1.7 U1.8 C24.1
N$19
  Top 0.762: U$3.P$4 C12.1 C13.1 L1.1
N$20
  Top 0.305: U1.2 123.44,43.38 123.97,42.85 123.97,42.29 125.53,40.73 R7.1
N$21
  Top 0.305: R7.2 137.99,40.73 arc90 138.81,41.55 C23.1 | C23.1 arc-90 C23.1 | SIPM.2 138.77,51.03 arc90 C23.1
N$22  (via drill 0.35)
  Top 0.305: U1.3 124.13,43.88 v125.41,42.6
  Top 0.508: C25.1 134.1,31.11 arc90 134.86,31.87 134.86,34.38 arc-90 R9.1
  Bottom 0.305: R9.1 134.87,34.45 134.87,37.21 134.83,37.57 134.83,39.18 arc90 134.25,39.76 133.44,39.76 arc-90 133.01,40.18 133.01,42.41 arc-90 133.11,42.5 | v125.41,42.6 125.48,42.53 132.29,42.5 133.11,42.5 | 133.11,42.5 135.51,42.5 arc90 136.13,43.11 136.13,44.66 arc90 R8.2
N$23
  Top 0.305: U1.16 122.18,41.62 126,37.8 C26.2
  Bottom 0.508: R11.2 C26.2
N$24
  Top 0.305: U1.6 U1.5 L7.1
N$25
  Top 0.305: U2.5 117.7,33.19 117.73,40.8 119.66,41.4 120.56,41.73 120.66,41.83 U1.13
N$27
  Top 0.305: U2.2 U2.1
  Bottom 0.305: U2.2 109.03,35.59 112.49,29.36 115.6,29.36 116.39,28.57 R16.2
N$28
  Top 0.305: U1.15 121.68,41.54 121.65,40.95 R9.2 124.74,34.28 C25.2 R10.2
N$29
  Top 0.305: R14.1 104.53,32.82 | U2.3 106.47,32.84 arc-90 106.46,32.82 104.53,32.82 | 104.53,32.82 R13.1
N$30
  Top 0.305: R12.2 118.58,44.42 U1.9
N$31
  Top 0.508: ZENERD.2 101.29,42.94 arc90 R14.2 103.54,42.93 arc90 D1.C 105.82,42.94 arc-90 R15.1
N$33
  Top 0.305: U1.14 121.18,41.83 | 121.18,41.83 121.18,41.69 | R16.1 120.14,40.75 121.11,41.08 121.18,41.83
  Top 0.508: R17.2 R16.1
N$34
  Top 0.762: VAR1.P$1 R18.2 R5.2 R17.1
N$35
  Top 0.305: C15.1 69.4,56.54 69.46,56.6 L4.5
  Top 0.762: L4.5 70.63,55.29 72.13,53.79 75.58,53.79 C2.2 85.07,53.81 U$1.P$3 U$1.P$4
N$36
  Top 0.508: C31.+ 511-L7805ACVMOUSER.IN PWR.2
SIPMGND
  Top 0.305: R12.1 105.66,46.28 106.38,45.56 115.17,45.56 116.85,43.88 U1.10
  Route2 0.305: 121.92,42.86 123.44,25.45 123.44,25.7
  pour Route2 (isolate 0.305): 133.6,63.8 145.03,52.37 145.03,-6.05 138.68,-12.4 104.39,-12.4 98.04,-6.05 98.04,54.91 106.93,63.8
  pour Top (isolate 0.305): 106.64,67.72 128.81,67.75 136.85,67.71 138.46,67.66 141.85,61.3 142.02,34.04 142.06,14.86 138.86,11.13 133.48,10.97 102.21,10.84 98.34,14.06 98.3,59.48

### Text on the board
tSilk: +Vin | +Vin | Digital | Analog Power